# EAGLE design VL53L0X Grove Adapter (EAGLE 9.2.2)
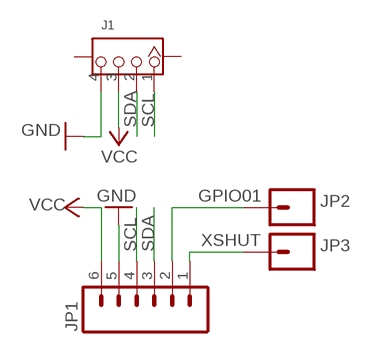
[diagram p0: schematic, sheet 1]

## Parts
J1  GROVE-CONNECTOR-4PINHW4-PTH-2.0  [HW4-PTH-2.0]
JP1  M06SIP  [1X06]
JP2  GPIO01  M01PTH  [1X01]
JP3  XSHUT  M01PTH  [1X01]

## Nets
GND: J1.4 JP1.5
GPIO01: JP1.2 JP2.1
SCL: J1.1 JP1.4
SDA: J1.2 JP1.3
VCC: J1.3 JP1.6
XSHUT: JP1.1 JP3.1
Unconnected: J1.5(SS1) J1.6(SS2)

## Library data of the parts
J1 = ItsyBitsy_Expander TestProg:GROVE-CONNECTOR-4PIN: 320110030
JP1 = SparkFun_center:M06: Header 6 Standard 6-pin 0.1" header. Use with straight break away headers (SKU : PRT-00116), right angle break away headers (PRT-00553), swiss pins (PRT-00743), machine pins (PRT-00117), and female headers (PRT-00115). Molex polarized connector foot print use with SKU : PRT-08094 with associated crimp pins and housings. NOTES ON THE VARIANTS LOCK and LOCK_LONGPADS... This footprint was designed to help hold the alignment of a through-hole component (i.e. 6-pin header) while soldering it into place. You may notice that each hole has been shifted either up or down by 0.005 of an inch from it's more standard position (which is a perfectly straight line). This slight alteration caused the pins (the squares in the middle) to touch the edges of the holes. Because they are alternating, it causes a "brace" to hold the component in place. 0.005 has proven to be the perfect amount of "off-center" position when using our standard breakaway headers. Although looks a little odd when you look at the bare footprint, once you have a header in there, the alteration is very hard to notice. Also, if you push a header all the way into place, it is covered up entirely on the bottom side. This idea of altering the position of holes to aid alignment will be further integrated into the Sparkfun Library for other footprints. It can help hold any component with 3 or more connection pins.
JP2 JP3 = SparkFun:M01: Header 1 Standard 1-pin 0.1" header. Use with straight break away headers (SKU : PRT-00116), right angle break away headers (PRT-00553), swiss pins (PRT-00743), machine pins (PRT-00117), and female headers (PRT-00115).

## Board
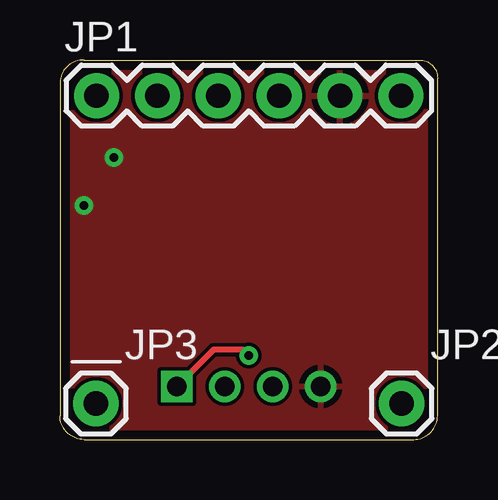
[diagram p1: board, top side]
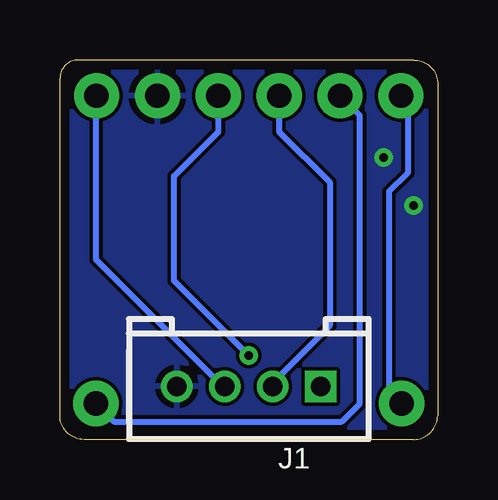
[diagram p2: board, bottom side, seen from below]

Size 15.75 x 15.81 mm. Coordinates in mm from the lower left corner, seen from the top.
Outline: 1,0 14.75,0 arc90 15.75,1 15.75,15.06 arc90 15,15.81 1,15.81 arc90 0,14.88 0,1 arc90 1,0
Copper layers (1*16): Top 0.035mm / dielectric 1.5mm / Bottom 0.035mm
Design rules "default *": minimum track width 6mil, minimum drill 0.35mm, track to track 6mil, track to pad 6mil, pad to pad 6mil, via to via 6mil, smd to smd 6mil, copper to edge 0.4mm, drill to drill 6mil, minimum pad ring 10mil, minimum via ring 8mil, stop-mask expansion 4mil, vias tented up to drill 20mil, thermal gap 10mil

### Footprints (pad centres in the part's own frame; a part is rotated, then mirrored left to right if it is on the bottom)
HW4-PTH-2.0 = drill 0.8 pad 1.27 square: 1 -3,3.5 | drill 0.8 pad 1.27: 2 -1,3.5; 3 1,3.5; 4 3,3.5 | smd 0 x 0: 5 1.27,3.5; 6 0.635,3.5
1X06 = drill 1.016 pad 1.88: 1 -6.35,0; 2 -3.81,0; 3 -1.27,0; 4 1.27,0; 5 3.81,0; 6 6.35,0
1X01 = drill 1.016 pad 1.88: 1 0,0

### Placement (x,y rotation side)
J1  7.88,5.71 180 bottom
JP1  7.88,14.32 0 top
JP2  14.25,1.5 0 top
JP3  1.5,1.5 0 top

### Tracks (layer width: path | path; a pad name or v marks a point on that pad's centre or on a via)
GND  (via drill 0.35)
  other vias: 2.25,11.75 1,9.75
  pour Top: -1,16.25 -1,-1 16.75,-1 16.75,16.5 -1,16.5
  pour Bottom: -0.5,16 -0.5,-0.5 16.25,-0.5 16.25,16
GPIO01
  Bottom 0.254: JP2.1 13.5,0.75 4,0.75 3.25,1.5 3.25,13.51 JP1.2
SCL  (via drill 0.35)
  Top 0.254: v7.88,3.5 7.62,3.75 6.41,3.75 J1.1
  Bottom 0.254: v7.88,3.5 11,6.62 11,10.97 9.14,12.82 JP1.4
SDA
  Bottom 0.254: JP1.3 6.61,12.82 4.5,10.72 4.5,4.75 6.88,2.38 J1.2
VCC
  Bottom 0.254: J1.3 8.96,2.21 14.25,7.5 14.25,14.3 JP1.6
XSHUT
  Bottom 0.254: JP1.1 1.25,14.05 1.25,11.1 2.02,10.32 2.02,2.02 JP3.1